# EAGLE design Leak Detector 2B (EAGLE 6.5.0)
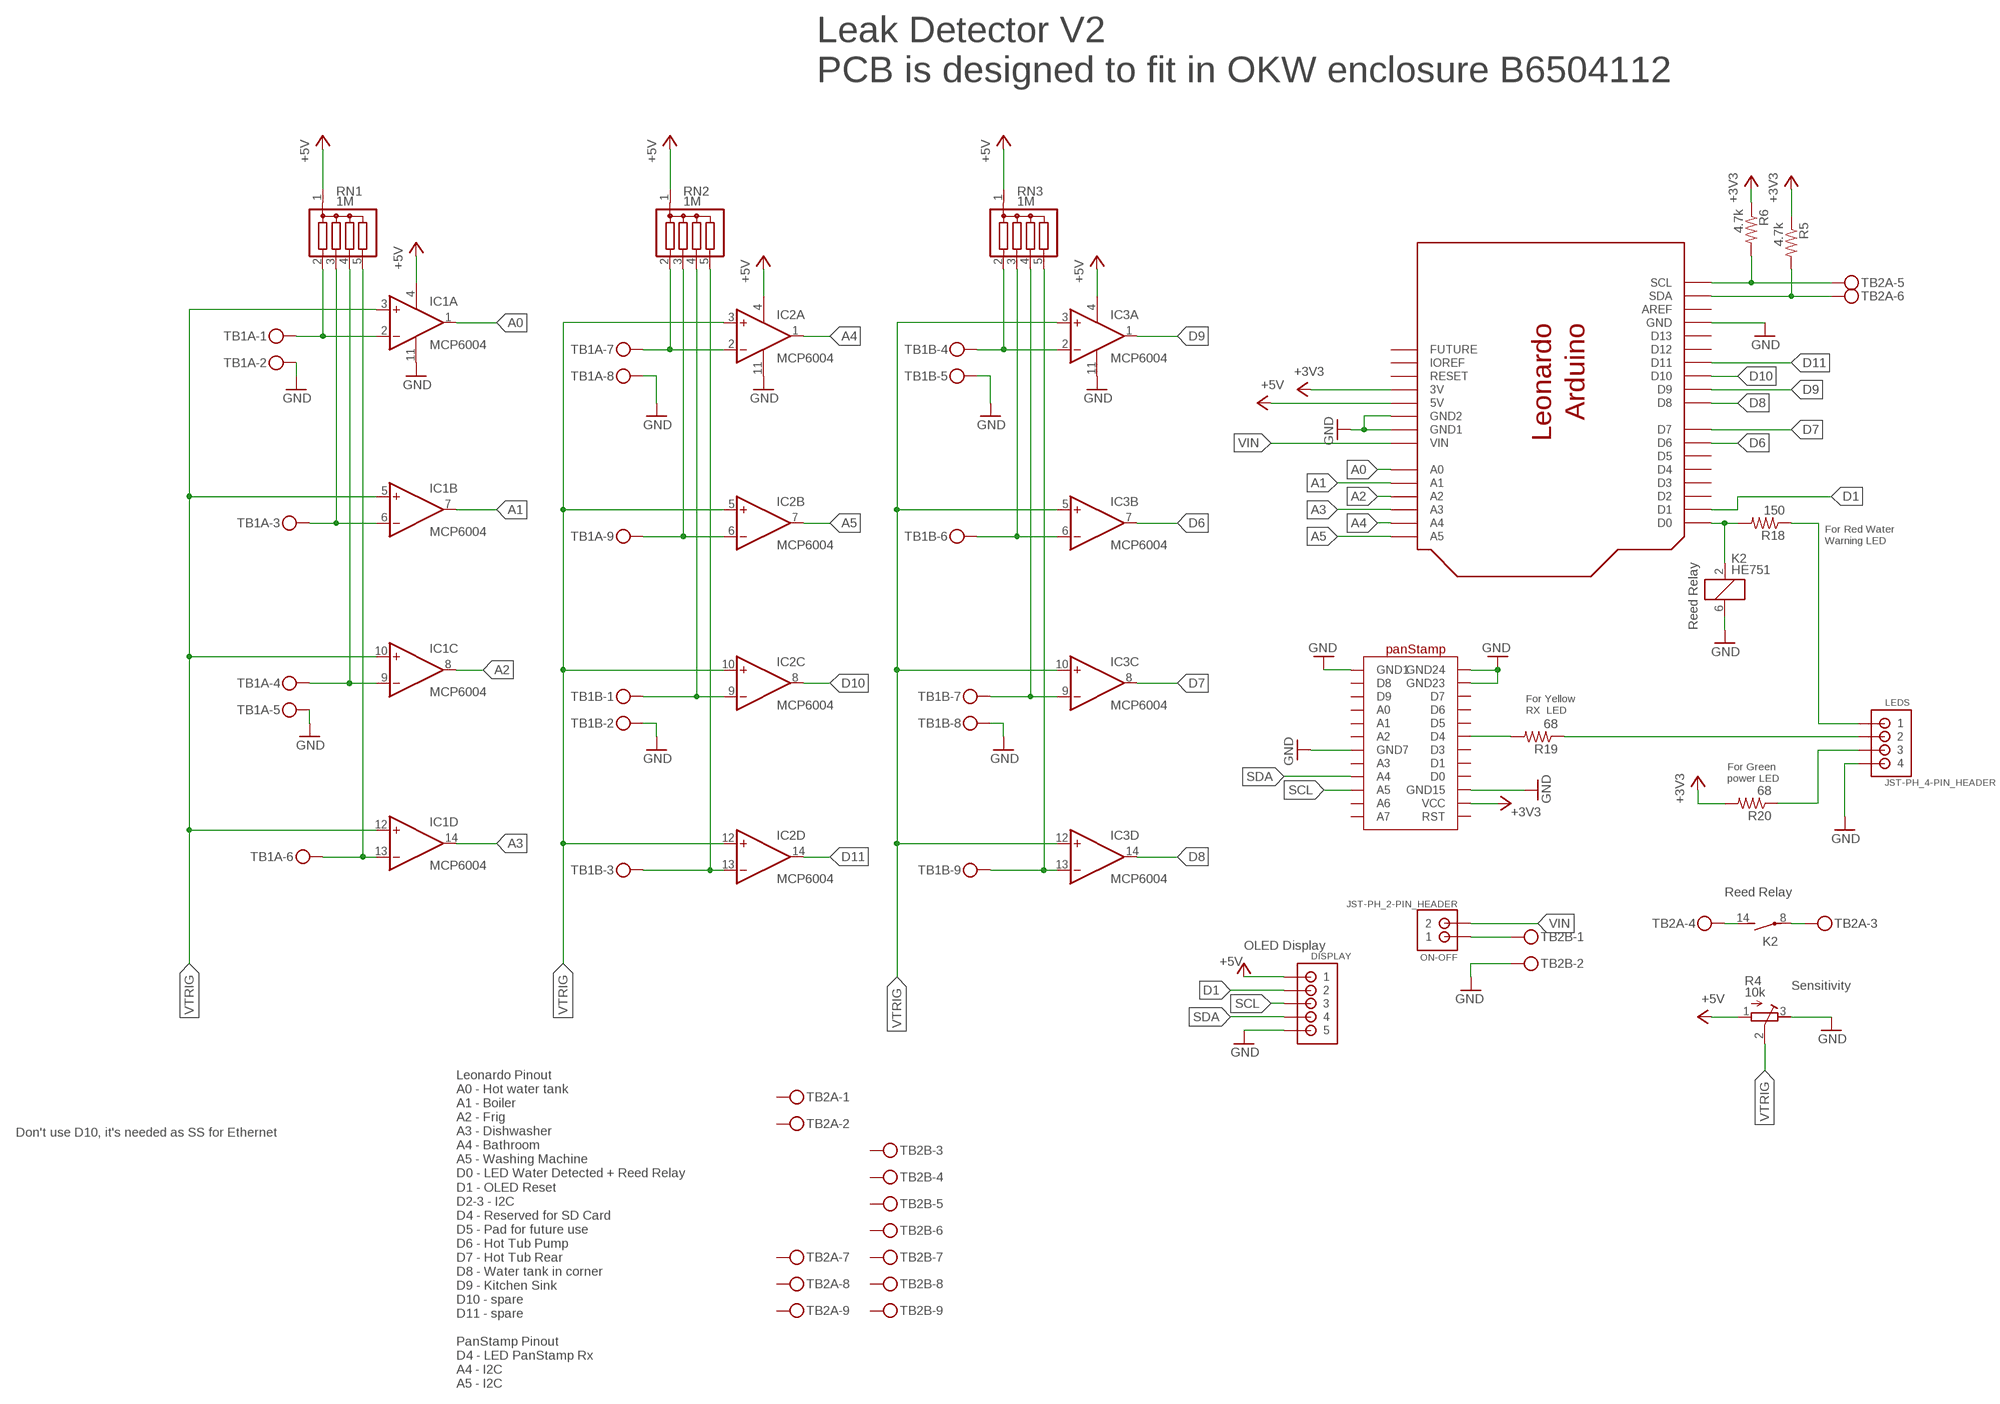
[diagram p0: schematic, sheet 1]

## Parts
DISPLAY  JST-PH_5-PIN_HEADER  [JST_B5B-PH_HEADER]
IC1  MCP6004  MCP604P  [DIL14]
IC2  MCP6004  MCP604P  [DIL14]
IC3  MCP6004  MCP604P  [DIL14]
K2  HE751  [HE751]
LEDS  JST-PH_4-PIN_HEADER  [JST_B4B-PH_HEADER]
ON-OFF  JST-PH_2-PIN_HEADER  [JST_B2B-PH_HEADER]
R4  10k  R-TRIMM3296P  [RTRIM3296P]
R5  4.7k  R-US_0207/10  [0207/10]
R6  4.7k  R-US_0207/10  [0207/10]
R18  150  R-US_0207/10  [0207/10]
R19  68  R-US_0207/10  [0207/10]
R20  68  R-US_0207/10  [0207/10]
RN1  1M  G04R  [SIL5]
RN2  1M  G04R  [SIL5]
RN3  1M  G04R  [SIL5]
TB1A  MKDSN1,5/9-5,08  [MKDSN1,5/9-5,08]
TB1B  MKDSN1,5/9-5,08  [MKDSN1,5/9-5,08]
TB2A  MKDSN1,5/9-5,08  [MKDSN1,5/9-5,08]
TB2B  MKDSN1,5/9-5,08  [MKDSN1,5/9-5,08]
U$1  ARDUINO_LEONARDO  [ARDUINO_LEONARDO]
U$2  PANSTAMP  [PANSTAMP]

## Nets
+3V3 [Power]: R5.1 R6.1 R20.2 U$1.3V U$2.VCC
+5V [Power]: DISPLAY.P1 IC1.4(P:V+) IC2.4(P:V+) IC3.4(P:V+) R4.1(E) RN1.1 RN2.1 RN3.1 U$1.5V
A0: IC1.1(A:OUT) U$1.A0
A1: IC1.7(B:OUT) U$1.A1
A2: IC1.8(C:OUT) U$1.A2
A3: IC1.14(D:OUT) U$1.A3
A4: IC2.1(A:OUT) U$1.A4
A5: IC2.7(B:OUT) U$1.A5
BATHROOM: IC2.2(A:-IN) RN2.2 TB1A.7
BOILER: IC1.6(B:-IN) RN1.3 TB1A.3
D1: DISPLAY.P2 U$1.D1
D6: IC3.7(B:OUT) U$1.D6
D7: IC3.8(C:OUT) U$1.D7
D8: IC3.14(D:OUT) U$1.D8
D9: IC3.1(A:OUT) U$1.D9
D10: IC2.8(C:OUT) U$1.D10
D11: IC2.14(D:OUT) U$1.D11
DISHWASHER: IC1.13(D:-IN) RN1.5 TB1A.6
FRIG: IC1.9(C:-IN) RN1.4 TB1A.4
GND [Power]: DISPLAY.P5 IC1.11(P:V-) IC2.11(P:V-) IC3.11(P:V-) K2.6 LEDS.P4 R4.3(A) TB1A.2 TB1A.5 TB1A.8 TB1B.2 TB1B.5 TB1B.8 TB2B.2 U$1.GND U$1.GND$2(GND2) U$1.GND$3(GND1) U$2.GND1 U$2.GND7 U$2.GND15 U$2.GND23 U$2.GND24
HAVEPOWER: LEDS.P3 R20.1
HOT_TUB_PUMP: IC3.6(B:-IN) RN3.3 TB1B.6
HOT_TUB_REAR: IC3.9(C:-IN) RN3.4 TB1B.7
HOT_WATER_TANK: IC1.2(A:-IN) RN1.2 TB1A.1
ISWATER: LEDS.P1 R18.1
N$1 [Power]: ON-OFF.P1 TB2B.1
N$2: K2.2 R18.2 U$1.D0
N$4: K2.14(2:S) TB2A.4
N$5: K2.8(2:P) TB2A.3
N$34: R19.2 U$2.D4
RXOK: LEDS.P2 R19.1
SCL: DISPLAY.P3 R6.2 TB2A.5 U$1.SCL U$2.A5
SDA: DISPLAY.P4 R5.2 TB2A.6 U$1.SDA U$2.A4
SINK: IC3.2(A:-IN) RN3.2 TB1B.4
SPARE1: IC2.9(C:-IN) RN2.4 TB1B.1
SPARE2: IC2.13(D:-IN) RN2.5 TB1B.3
VIN [Power]: ON-OFF.P2 U$1.VIN
VTRIG: IC1.3(A:+IN) IC1.5(B:+IN) IC1.10(C:+IN) IC1.12(D:+IN) IC2.3(A:+IN) IC2.5(B:+IN) IC2.10(C:+IN) IC2.12(D:+IN) IC3.3(A:+IN) IC3.5(B:+IN) IC3.10(C:+IN) IC3.12(D:+IN) R4.2(S)
WASH_MACH: IC2.6(B:-IN) RN2.3 TB1A.9
WATER_TANK: IC3.13(D:-IN) RN3.5 TB1B.9
Unconnected: TB2A.1 TB2A.2 TB2A.7 TB2A.8 TB2A.9 TB2B.3 TB2B.4 TB2B.5 TB2B.6 TB2B.7 TB2B.8 TB2B.9 U$1.AREF U$1.D2 U$1.D3 U$1.D4 U$1.D5 U$1.D12 U$1.D13 U$1.IOREF U$1.RESERVED(FUTURE) U$1.RESET U$2.A0 U$2.A1 U$2.A2 U$2.A3 U$2.A6 U$2.A7 U$2.D0 U$2.D1 U$2.D3 U$2.D5 U$2.D6 U$2.D7 U$2.D8 U$2.D9 U$2.RESET(RST)

## Notes on the sheet
- Leak Detector V2
  PCB is designed to fit in OKW enclosure B6504112
- For Red Water
  Warning LED
- Reed Relay
- For Yellow 
  RX  LED
- For Green 
  power LED
- Reed Relay
- OLED Display
- Sensitivity
- Leonardo Pinout
  A0 - Hot water tank
  A1 - Boiler
  A2 - Frig
  A3 - Dishwasher
  A4 - Bathroom
  A5 - Washing Machine
  D0 - LED Water Detected + Reed Relay
  D1 - OLED Reset
  D2-3 - I2C 
  D4 - Reserved for SD Card
  D5 - Pad for future use
  D6 - Hot Tub Pump
  D7 - Hot Tub Rear
  D8 - Water tank in corner
  D9 - Kitchen Sink
  D10 - spare
  D11 - spare
  
  PanStamp Pinout
  D4 - LED PanStamp Rx 
  A4 - I2C
  A5 - I2C
- Don't use D10, it's needed as SS for Ethernet

## Library data of the parts
DISPLAY = SRG:JST-PH_5-PIN_HEADER: 5-pin JST PH Shrouded Header, top entry P/N B5B-PH-K-S Mating connector PHR-5
IC1-IC3 = linear:MCP604: Quad Op Amp 2.7V to 6.0V Single Supply CMOS Source: http://ww1.microchip.com/downloads/en/DeviceDoc/21314g.pdf
K2 = relay:HE751: RELAY reed, 1 x norm. open, Hamlin; OC_FARNELL: unknown; OC_NEWARK: unknown
LEDS = SRG:JST-PH_4-PIN_HEADER: 4-pin JST PH Shrouded Header, top entry P/N B4B-PH-K-S Mating connector PHR-4
ON-OFF = SRG:JST-PH_2-PIN_HEADER: 2-pin JST PH Shrouded Header, top entry P/N B2B-PH-K-S Mating connector PHR-2 Mating cable assembly: Sparkfun PRT-09914 <http://www.sparkfun.com/products/9914>
R4 = resistor:R-TRIMM: Trimm resistor
R5 R6 R18-R20 = rcl:R-US_: RESISTOR, American symbol
RN1-RN3 = resistor-sil:G04R: SIL RESISTOR; OC_FARNELL: unknown; OC_NEWARK: unknown
TB1A TB1B TB2A TB2B = con-phoenix-508:MKDSN1,5/9-5,08: MKDSN 1,5/ 9-5,08 Printklemme Nennstrom: 13,5 A Nennspannung: 250 V Rastermaß: 5,08 mm Polzahl: 9 Anschlussart: Schraubanschluss Montage: Löten Anschlussrichtung Leiter/Platine: 0 ° Artikelnummer: 1729199 Source: http://eshop.phoenixcontact.com .. 1729199.pdf; MPN: SMKDSN1,5/9-5,08; OC_FARNELL: 1792912; OC_NEWARK: 70R0305
U$1 = SRG:ARDUINO_LEONARDO: Arduino Leonardo I2C Pins: D2, D3 PWM Pins: D3, D5, D5, D11, D13 Interrup Pint: D2, D3 http://arduino.cc/en/Main/arduinoBoardLeonardo
U$2 = SRG:PANSTAMP: panStamp panStamps are small wireless modules programmable from the Arduino IDE. Each module contains an Atmega328p MCU and a Texas Instruments CC1101 RF interface, providing the necessary connectivity and processing power to create autonomous low-power wireless motes. Everything contained into a compact DIP-24 module. http://www.panstamp.com Vin: 2.5 to 3.6 volts A4 - SDA A5 - SCL PWM: D3,5,6,9,10,11 Interrupts: D2,3

## Net classes
0 default: width 0.305 mm, drill 0.508 mm, clearance 0.305 mm
1 Power: width 0.508 mm, drill 0.508 mm, clearance 0.305 mm

## Board
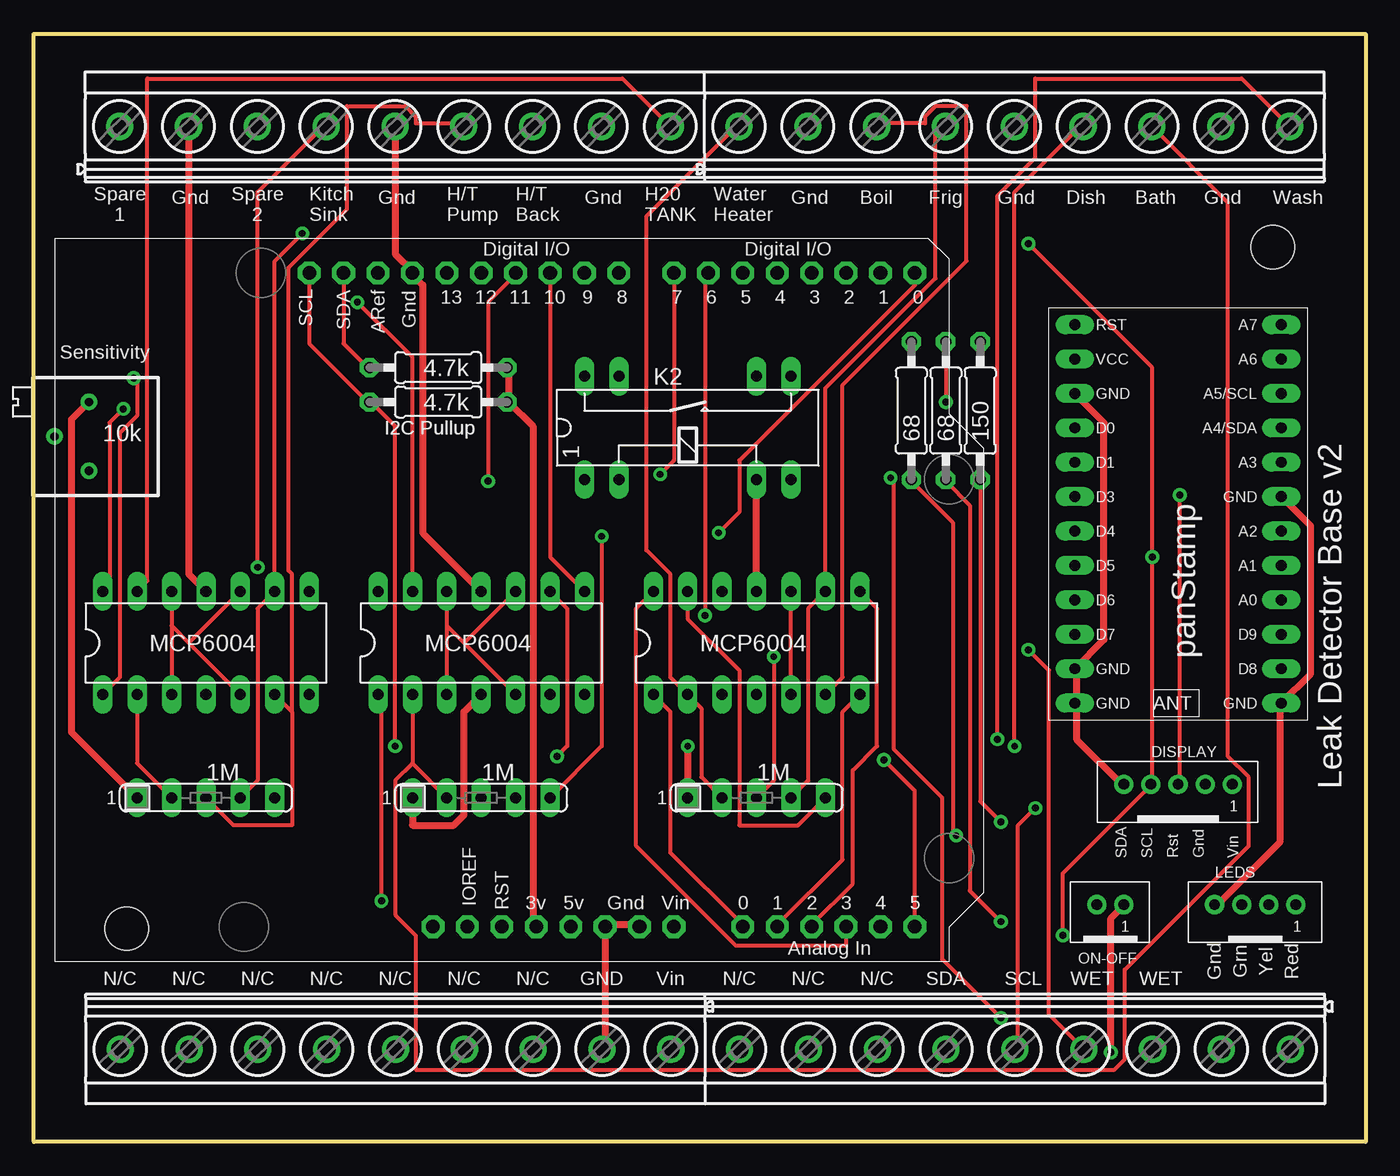
[diagram p1: board, top side]
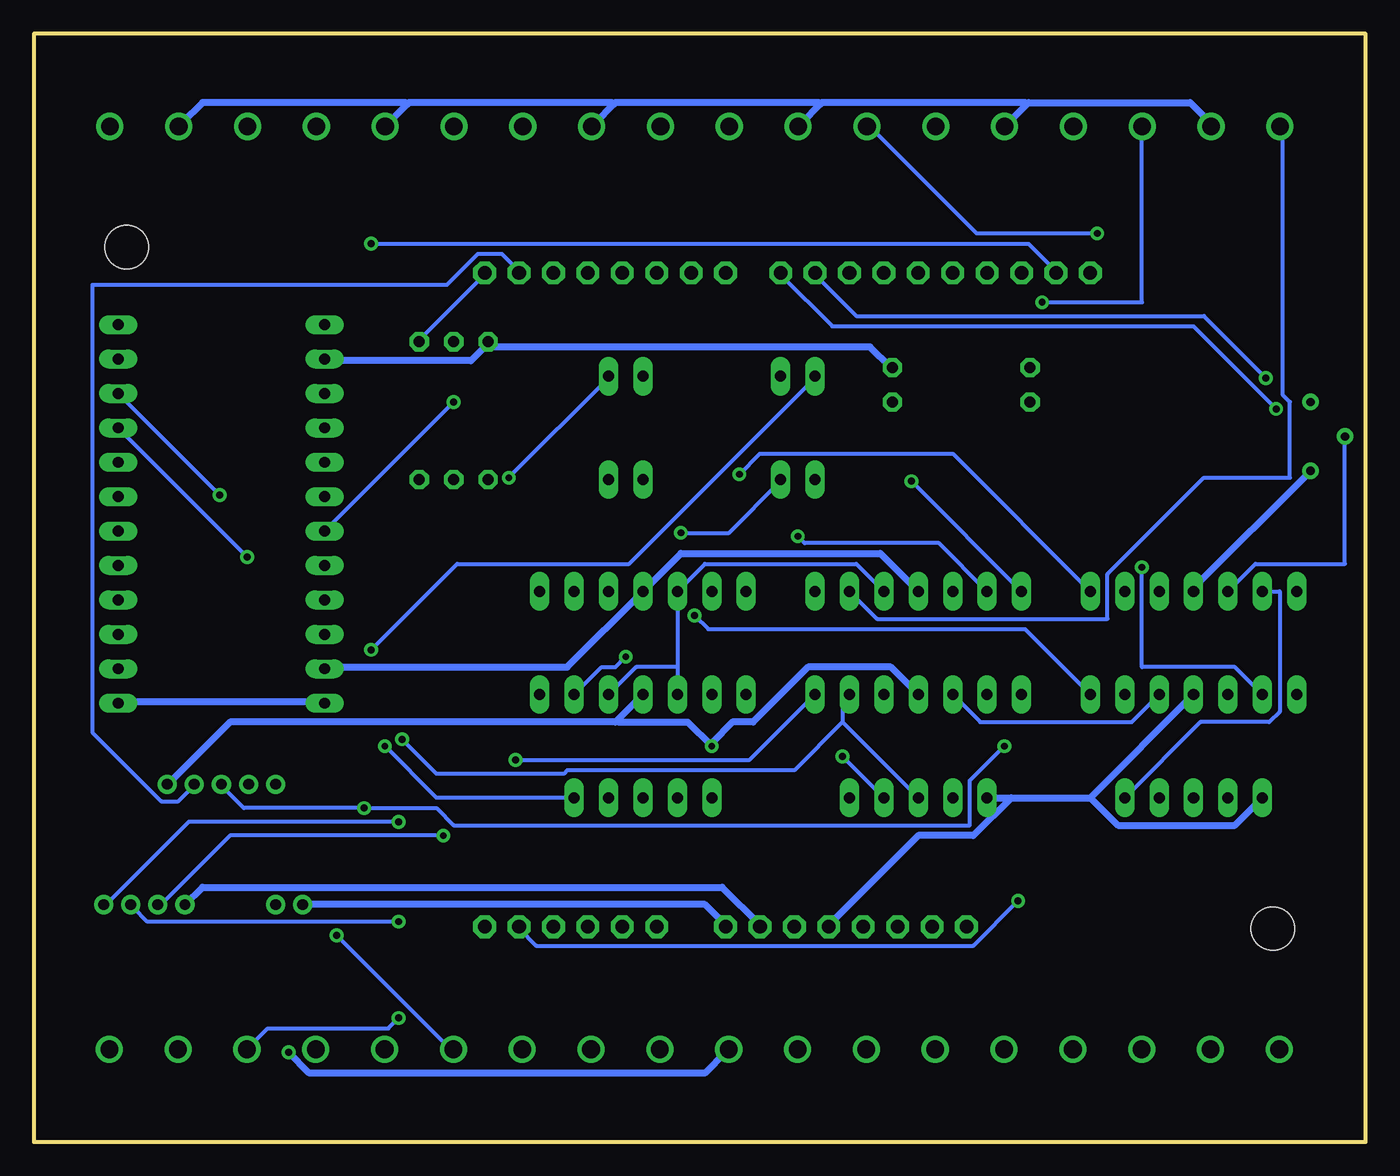
[diagram p2: board, bottom side, seen from below]

Size 98.3 x 81.79 mm. Coordinates in mm from the lower left corner, seen from the top.
Outline: 0,0 0,81.79 98.3,81.79 98.3,0 0,0
Copper layers (1*16): Top 0.035mm / dielectric 1.5mm / Bottom 0.035mm
Design rules "SparkFun10mil": minimum track width 10mil, minimum drill 20mil, track to track 10mil, track to pad 10mil, pad to pad 10mil, via to via 10mil, smd to smd 10mil, copper to edge 10mil, drill to drill 10mil, minimum pad ring 12mil, minimum via ring 10mil, stop-mask expansion 4mil, vias tented up to drill 25mil, thermal gap 10mil
Holes 3.2 mm at 6.86,15.75 91.44,66.04
tRestrict: area 88.6,63.2 to 94.2,68.8; area 4.6,13.5 to 9.1,18
bRestrict: area 4.6,13.5 to 9.1,18; area 89.2,63.8 to 93.7,68.3

### Footprints (pad centres in the part's own frame; a part is rotated, then mirrored left to right if it is on the bottom)
JST_B5B-PH_HEADER = drill 0.8: P1 4,1; P2 2,1; P3 0,1; P4 -2,1; P5 -4,1
DIL14 = drill 0.813 long: 1 -7.62,-3.81; 2 -5.08,-3.81; 3 -2.54,-3.81; 4 0,-3.81; 5 2.54,-3.81; 6 5.08,-3.81; 7 7.62,-3.81; 8 7.62,3.81; 9 5.08,3.81; 10 2.54,3.81; 11 0,3.81; 12 -2.54,3.81; 13 -5.08,3.81; 14 -7.62,3.81
HE751 = drill 0.813 long: 1 -7.62,-3.81; 2 -5.08,-3.81; 6 5.08,-3.81; 7 7.62,-3.81; 8 7.62,3.81; 9 5.08,3.81; 13 -5.08,3.81; 14 -7.62,3.81
JST_B4B-PH_HEADER = drill 0.8: P1 2.98,1; P2 0.98,1; P3 -1.02,1; P4 -3.02,1
JST_B2B-PH_HEADER = drill 0.8: P1 1.71,1; P2 -0.29,1
RTRIM3296P = drill 0.61: 1 0,-2.54; 2 2.54,0; 3 0,2.54
0207/10 = drill 0.813 octagon: 1 -5.08,0; 2 5.08,0
SIL5 = drill 0.813 long: 1 -5.08,0; 2 -2.54,0; 3 0,0; 4 2.54,0; 5 5.08,0
MKDSN1,5/9-5,08 = drill 1.3 pad 2: 1 -20.341,0.025; 2 -15.261,0.025; 3 -10.181,0.025; 4 -5.101,0.025; 5 -0.021,0.025; 6 5.059,0.025; 7 10.139,0.025; 8 15.219,0.025; 9 20.299,0.025
ARDUINO_LEONARDO = drill 1 pad 1.676 octagon: 3V 1.27,-24.13; 5V 3.81,-24.13; A0 16.51,-24.13; A1 19.05,-24.13; A2 21.59,-24.13; A3 24.13,-24.13; A4 26.67,-24.13; A5 29.21,-24.13; AREF -10.414,24.13; D0 29.21,24.13; D1 26.67,24.13; D2 24.13,24.13; D3 21.59,24.13; D4 19.05,24.13; D5 16.51,24.13; D6 13.97,24.13; D7 11.43,24.13; D8 7.366,24.13; D9 4.826,24.13; D10 2.286,24.13; D11 -0.254,24.13; D12 -2.794,24.13; D13 -5.334,24.13; GND -7.874,24.13; GND$2 8.89,-24.13; GND$3 6.35,-24.13; IOREF -3.81,-24.13; RESERVED -6.35,-24.13; RESET -1.27,-24.13; SCL -15.494,24.13; SDA -12.954,24.13; VIN 11.43,-24.13
PANSTAMP = drill 0.8 long: A0 -7.62,7.62; A1 -7.62,5.08; A2 -7.62,2.54; A3 -7.62,-2.54; A4 -7.62,-5.08; A5 -7.62,-7.62; A6 -7.62,-10.16; A7 -7.62,-12.7; D0 7.62,-5.08; D1 7.62,-2.54; D3 7.62,0; D4 7.62,2.54; D5 7.62,5.08; D6 7.62,7.62; D7 7.62,10.16; D8 -7.62,12.7; D9 -7.62,10.16; GND1 -7.62,15.24; GND7 -7.62,0; GND15 7.62,-7.62; GND23 7.62,12.7; GND24 7.62,15.24; RESET 7.62,-12.7; VCC 7.62,-10.16

### Placement (x,y rotation side)
DISPLAY  84.45,25.4 0 top
IC1  53.34,36.83 0 top
IC2  33.02,36.83 0 top
IC3  12.7,36.83 0 top
K2  48.26,52.7 0 top
LEDS  90.17,16.51 0 top
ON-OFF  78.74,16.51 0 top
R4  4.06,52.07 180 top
R5  29.84,57.15 180 top
R6  29.84,54.61 180 top
R18  69.85,53.98 90 top
R19  67.31,53.98 90 top
R20  64.77,53.98 90 top
RN1  53.34,25.4 0 top
RN2  33.02,25.4 0 top
RN3  12.7,25.4 0 top
TB1A  72.39,74.93 0 top
TB1B  26.67,74.93 0 top
TB2A  72.39,6.86 180 top
TB2B  26.67,6.86 180 top
U$1  35.81,40.01 0 top
U$2  84.45,47.62 180 top

### Tracks (layer width: path | path; a pad name or v marks a point on that pad's centre or on a via)
+3V3
  Top 0.508: 35.05,54.61 35.05,57.15 R5.1 | 35.05,54.61 36.83,52.83 36.83,16.26 37.08,16 U$1.3V | 35.05,54.61 R6.1
  Bottom 0.508: U$2.VCC 76.71,57.66 66.04,57.66 64.77,58.93 R20.2 64.77,58.67 36.58,58.67 35.05,57.15 R5.1
+5V  (via drill 0.51)
  Top 0.508: v48.26,29.21 RN1.1 | R4.1 2.79,53.34 2.79,30.23 RN3.1 | IC2.4 31.75,31.75 31.75,24.13 30.99,23.37 27.94,23.37 RN2.1
  Bottom 0.508: IC1.4 55.24,31.11 | 55.24,31.11 55.37,30.99 83.82,30.99 88.39,26.42 DISPLAY.P1 | 55.24,31.11 55.12,30.99 50.04,30.99 v48.26,29.21 48.26,29.46 46.74,30.99 45.21,30.99 41.15,35.05 35.05,35.05 IC2.4 | 20.32,25.4 IC3.4 | RN2.1 26.16,25.4 | 26.16,25.4 20.32,25.4 | 26.16,25.4 28.96,22.61 33.02,22.61 39.62,16 U$1.5V | RN3.1 9.65,23.37 18.29,23.37 20.32,25.4
A0
  Top 0.305: IC1.1 46.99,31.75 46.99,21.34 52.32,16 U$1.A0
A1
  Top 0.305: IC1.7 59.69,31.75 59.69,20.83 54.86,16 U$1.A1
A2
  Top 0.305: IC1.8 62.23,39.37 62.23,29.21 60.45,27.43 60.45,19.05 57.4,16 U$1.A2
A3
  Top 0.305: IC1.14 44.45,39.37 44.45,21.84 51.82,14.48 59.94,14.48 U$1.A3
A4  (via drill 0.51)
  Top 0.305: IC2.1 25.65,32.77 v25.65,17.78
  Bottom 0.305: v25.65,17.78 28.96,14.48 61.21,14.48 62.48,15.75 U$1.A4
A5  (via drill 0.51)
  Top 0.305: v62.74,28.19 65.02,25.91 U$1.A5
  Bottom 0.305: IC2.7 45.47,28.19 v62.74,28.19
BATHROOM
  Top 0.305: 27.94,27.94 RN2.2 | IC2.2 27.94,27.94 | 27.94,27.94 26.67,26.67 26.67,16.76 28.19,15.24 28.19,5.33 79.76,5.33 80.52,6.1 80.52,12.7 89.66,21.84 89.66,26.92 88.14,28.45 88.14,69.34 82.55,74.93 TB1A.7
BOILER  (via drill 0.51)
  Top 0.305: RN1.3 54.61,26.67 v54.61,35.81 | IC1.6 59.69,34.29 59.69,55.88 68.83,65.02 68.83,76.45 66.55,76.45 65.79,75.69 65.79,75.18 62.23,75.18 TB1A.3
  Bottom 0.305: v54.61,35.81 55.37,35.05 56.39,35.05 IC1.6
D1
  Bottom 0.305: DISPLAY.P2 86.61,26.16 87.63,25.15 88.9,25.15 93.98,30.23 93.98,63.25 67.82,63.25 65.53,65.53 63.75,65.53 62.48,64.26 U$1.D1
D6  (via drill 0.51)
  Top 0.305: v49.53,38.86 49.53,63.75 49.78,64.01 U$1.D6
  Bottom 0.305: IC3.7 25.15,37.85 48.51,37.85 v49.53,38.86
D7  (via drill 0.51)
  Top 0.305: v46.23,49.28 47.24,50.29 U$1.D7
  Bottom 0.305: IC3.8 30.48,50.8 44.7,50.8 v46.23,49.28
D8  (via drill 0.51)
  Top 0.305: IC3.14 5.59,41.15 5.59,53.09 v6.6,54.1
  Bottom 0.305: v6.6,54.1 12.7,60.2 39.37,60.2 43.18,64.01 U$1.D8
D9  (via drill 0.51)
  Top 0.305: IC3.1 6.35,34.29 6.35,52.32 7.62,53.59 7.62,56.13 v7.37,56.39
  Bottom 0.305: v7.37,56.39 11.94,60.96 37.59,60.96 40.64,64.01 U$1.D9
D10
  Top 0.305: IC2.8 38.1,43.18 U$1.D10
D11  (via drill 0.51)
  Top 0.305: v33.53,48.77 33.53,61.98 35.56,64.01 U$1.D11
  Bottom 0.305: v33.53,48.77 IC2.14
DISHWASHER  (via drill 0.51)
  Top 0.305: RN1.5 56.39,23.37 52.07,23.37 52.07,34.8 48.26,38.61 IC1.13 | v72.39,29.21 72.39,70.1 77.22,74.93 TB1A.6
  Bottom 0.305: v72.39,29.21 68.58,25.4 RN1.5
FRIG
  Top 0.305: RN1.4 57.15,26.67 57.15,39.37 IC1.9 58.42,55.63 66.55,63.75 66.55,74.42 67.06,74.93 TB1A.4
GND
  Top 0.508: IC1.11 K2.6 | DISPLAY.P5 80.26,26.42 76.96,29.72 76.96,32.26 U$2.GND24 76.96,32.51 76.96,34.8 U$2.GND23 78.99,37.08 78.99,53.09 U$2.GND15 | U$1.GND$2 44.7,16 42.16,16 U$1.GND$3 42.16,6.86 TB2B.2 | LEDS.P4 87.38,17.53 91.95,22.1 91.95,32.26 U$2.GND1 94.23,34.54 94.23,45.47 U$2.GND7 | TB1B.5 26.67,74.93 26.67,65.53 27.94,64.26 U$1.GND 27.94,64.01 28.7,63.25 28.7,44.96 IC2.11 | IC3.11 11.43,41.91 11.43,74.93 TB1B.2
  Bottom 0.508: IC2.11 35.81,43.43 50.55,43.43 IC1.11 58.93,35.05 76.71,35.05 U$2.GND23 | U$1.GND$2 44.7,16 47.5,18.8 85.85,18.8 87.12,17.53 LEDS.P4 | U$2.GND24 76.96,32.51 91.95,32.51 U$2.GND1 | R4.3 12.7,40.89 IC3.11 | 25.02,76.58 26.42,75.18 TB1B.5 | 25.02,76.58 24.89,76.71 12.95,76.71 11.43,75.18 TB1B.2 | 40.26,76.58 40.13,76.71 25.15,76.71 25.02,76.58 | 40.26,76.58 41.66,75.18 TB1B.8 | 55.5,76.58 55.37,76.71 40.39,76.71 40.26,76.58 | 55.5,76.58 56.9,75.18 TB1A.2 | 70.74,76.58 70.61,76.71 55.63,76.71 55.5,76.58 | 70.74,76.58 72.14,75.18 TB1A.5 | TB1A.8 87.38,75.18 85.85,76.71 70.87,76.71 70.74,76.58
HAVEPOWER  (via drill 0.51)
  Top 0.305: v68.07,22.61 67.82,22.86 67.82,45.72 64.77,48.77 R20.1
  Bottom 0.305: v68.07,22.61 83.82,22.61 88.9,17.53 LEDS.P3
HOT_TUB_PUMP
  Top 0.305: RN3.3 14.73,23.37 19.05,23.37 19.05,31.75 | IC3.6 19.05,31.75 | 19.05,31.75 19.05,41.91 18.8,42.16 18.8,64.52 23.11,68.83 23.11,76.45 27.43,76.45 28.19,75.69 28.19,75.18 31.5,75.18 TB1B.6
HOT_TUB_REAR  (via drill 0.51)
  Top 0.305: RN3.4 16.51,26.67 16.51,39.37 IC3.9 17.78,65.02 v19.81,67.06
  Bottom 0.305: v19.81,67.06 28.7,67.06 36.58,74.93 TB1B.7
HOT_WATER_TANK
  Top 0.305: RN1.2 49.28,26.92 49.28,32 IC1.2 46.99,34.29 46.99,41.91 45.21,43.69 45.21,68.33 51.82,74.93 TB1A.1
ISWATER  (via drill 0.51)
  Top 0.305: v71.37,23.62 69.85,25.15 R18.1
  Bottom 0.305: v71.37,23.62 86.87,23.62 92.96,17.53 LEDS.P1
N$1  (via drill 0.51)
  Top 0.508: v79.5,6.6 79.5,16.51 80.26,17.27 ON-OFF.P1
  Bottom 0.508: v79.5,6.6 77.98,5.08 48.77,5.08 47.24,6.6 TB2B.1
N$2  (via drill 0.51)
  Top 0.305: v50.55,44.96 52.07,46.48 52.07,50.29 65.02,63.25 U$1.D0
  Bottom 0.305: v50.55,44.96 46.99,44.96 43.18,48.77 K2.2 | R18.2 69.85,59.18 65.02,64.01 U$1.D0
N$4  (via drill 0.51)
  Top 0.305: v73.41,36.32 74.93,34.8 74.93,9.4 77.47,6.86 TB2A.4
  Bottom 0.305: v73.41,36.32 67.06,42.67 54.36,42.67 40.64,56.39 K2.14
N$5  (via drill 0.51)
  Top 0.305: v63.25,49.02 63.5,48.77 63.5,28.96 67.06,25.4 67.06,13.46 v71.37,9.14
  Bottom 0.305: v63.25,49.02 55.88,56.39 K2.8 | v71.37,9.14 72.14,8.38 81.03,8.38 82.55,6.86 TB2A.3
N$34  (via drill 0.51)
  Top 0.305: R19.2 v67.31,54.61
  Bottom 0.305: v67.31,54.61 U$2.D4
RXOK  (via drill 0.51)
  Top 0.305: v71.37,16.26 69.09,18.54 69.09,46.99 67.31,48.77 R19.1
  Bottom 0.305: v71.37,16.26 89.92,16.26 90.93,17.27 LEDS.P2
SCL  (via drill 0.51)
  Top 0.305: U$1.SCL 20.32,58.93 24.64,54.61 R6.2 24.89,54.61 26.67,52.83 v26.67,29.21 | v73.91,24.64 72.64,23.37 72.64,6.86 TB2A.5 | v84.58,47.75 84.58,26.42 DISPLAY.P3
  Bottom 0.305: DISPLAY.P3 84.33,26.16 82.8,24.64 v73.91,24.64 68.58,24.64 67.31,23.37 29.21,23.37 29.21,26.67 v26.67,29.21 | v84.58,47.75 U$2.A5
SDA  (via drill 0.51)
  Top 0.305: U$1.SDA 22.86,58.93 24.64,57.15 R5.2 | v75.95,15.24 75.95,19.81 82.3,26.16 DISPLAY.P4 82.55,26.42 v82.55,43.18 82.55,57.15 v73.41,66.29
  Bottom 0.305: v75.95,15.24 67.56,6.86 TB2A.6 | v82.55,43.18 U$2.A4 | v73.41,66.29 24.89,66.29 22.86,64.26 U$1.SDA
SINK  (via drill 0.51)
  Top 0.305: RN3.2 7.62,27.94 IC3.2 | v16.51,42.42 16.51,70.1 21.34,74.93 TB1B.4
  Bottom 0.305: v16.51,42.42 16.51,35.05 9.65,35.05 IC3.2
SPARE1  (via drill 0.51)
  Top 0.305: v38.61,28.45 39.37,29.21 39.37,39.37 IC2.9
  Bottom 0.305: v38.61,28.45 RN2.4 | IC2.9 36.07,38.61 19.05,38.61 19.05,41.91 11.94,49.02 5.59,49.02 5.59,54.61 6.1,55.12 6.1,74.93 TB1B.1
SPARE2  (via drill 0.51)
  Top 0.305: RN2.5 41.91,29.21 v41.91,44.7 | v23.88,61.98 27.94,57.91 IC2.13
  Bottom 0.305: v41.91,44.7 41.4,44.2 31.5,44.2 IC2.13 | v23.88,61.98 16.51,61.98 16.51,74.93 TB1B.3
VIN
  Top 0.508: 47.24,16 U$1.VIN
  Bottom 0.508: ON-OFF.P2 78.23,17.53 48.77,17.53 47.24,16 U$1.VIN
VTRIG
  Top 0.305: IC3.12 10.16,38.1 | 10.16,38.1 IC3.3 | 10.16,38.1 11.43,36.83 | 11.43,36.83 IC3.5 | 11.43,36.83 IC3.10 | IC2.12 30.48,38.1 | 30.48,38.1 IC2.3 | 30.48,38.1 31.75,36.83 | 31.75,36.83 IC2.5 | 31.75,36.83 IC2.10 | IC1.5 IC1.10
  Bottom 0.305: R4.2 1.52,42.67 8.13,42.67 IC3.12 | 50.8,35.05 IC1.12 48.77,42.67 37.59,42.67 IC2.10 | 50.8,35.05 IC1.3 | IC1.5 53.85,35.05 50.8,35.05 | IC3.5 17.27,30.99 28.45,30.99 IC2.3
WASH_MACH  (via drill 0.51)
  Top 0.305: v71.12,29.72 71.12,69.85 73.91,72.64 73.91,78.49 89.15,78.49 92.46,75.18 TB1A.9
  Bottom 0.305: 38.61,30.99 RN2.3 | 38.61,30.99 38.61,33.02 IC2.6 | v71.12,29.72 68.58,27.18 59.18,27.18 58.93,27.43 42.16,27.43 38.61,30.99
WATER_TANK
  Top 0.305: IC3.13 8.38,41.4 8.38,78.49 43.43,78.49 46.74,75.18 TB1B.9
  Bottom 0.305: RN3.5 12.19,30.99 7.11,30.99 6.35,31.75 6.35,40.64 IC3.13

### Text on the board
tPlace: Leak Detector Base v2 | GND | Vin
tNames: Gnd | Gnd | Gnd | Gnd | Boil | Frig | Gnd | Dish | Bath | Gnd | Wash | Spare / 1 | Spare / 2 | Kitch / Sink | H/T / Pump | H/T / Back | H20 / TANK | Water / Heater | Sensitivity | I2C Pullup | I2C Pullup | SDA | SCL | Rst | Gnd | Vin | Gnd | Grn | Yel | Red | N/C | N/C | N/C | N/C | N/C | N/C | N/C | N/C | N/C | N/C | SDA | SCL | WET | WET